# Altium project PT-15-V1.0.PrjPcb (part 5 of 7)

## Sheet 11-LED.schdoc
size A2
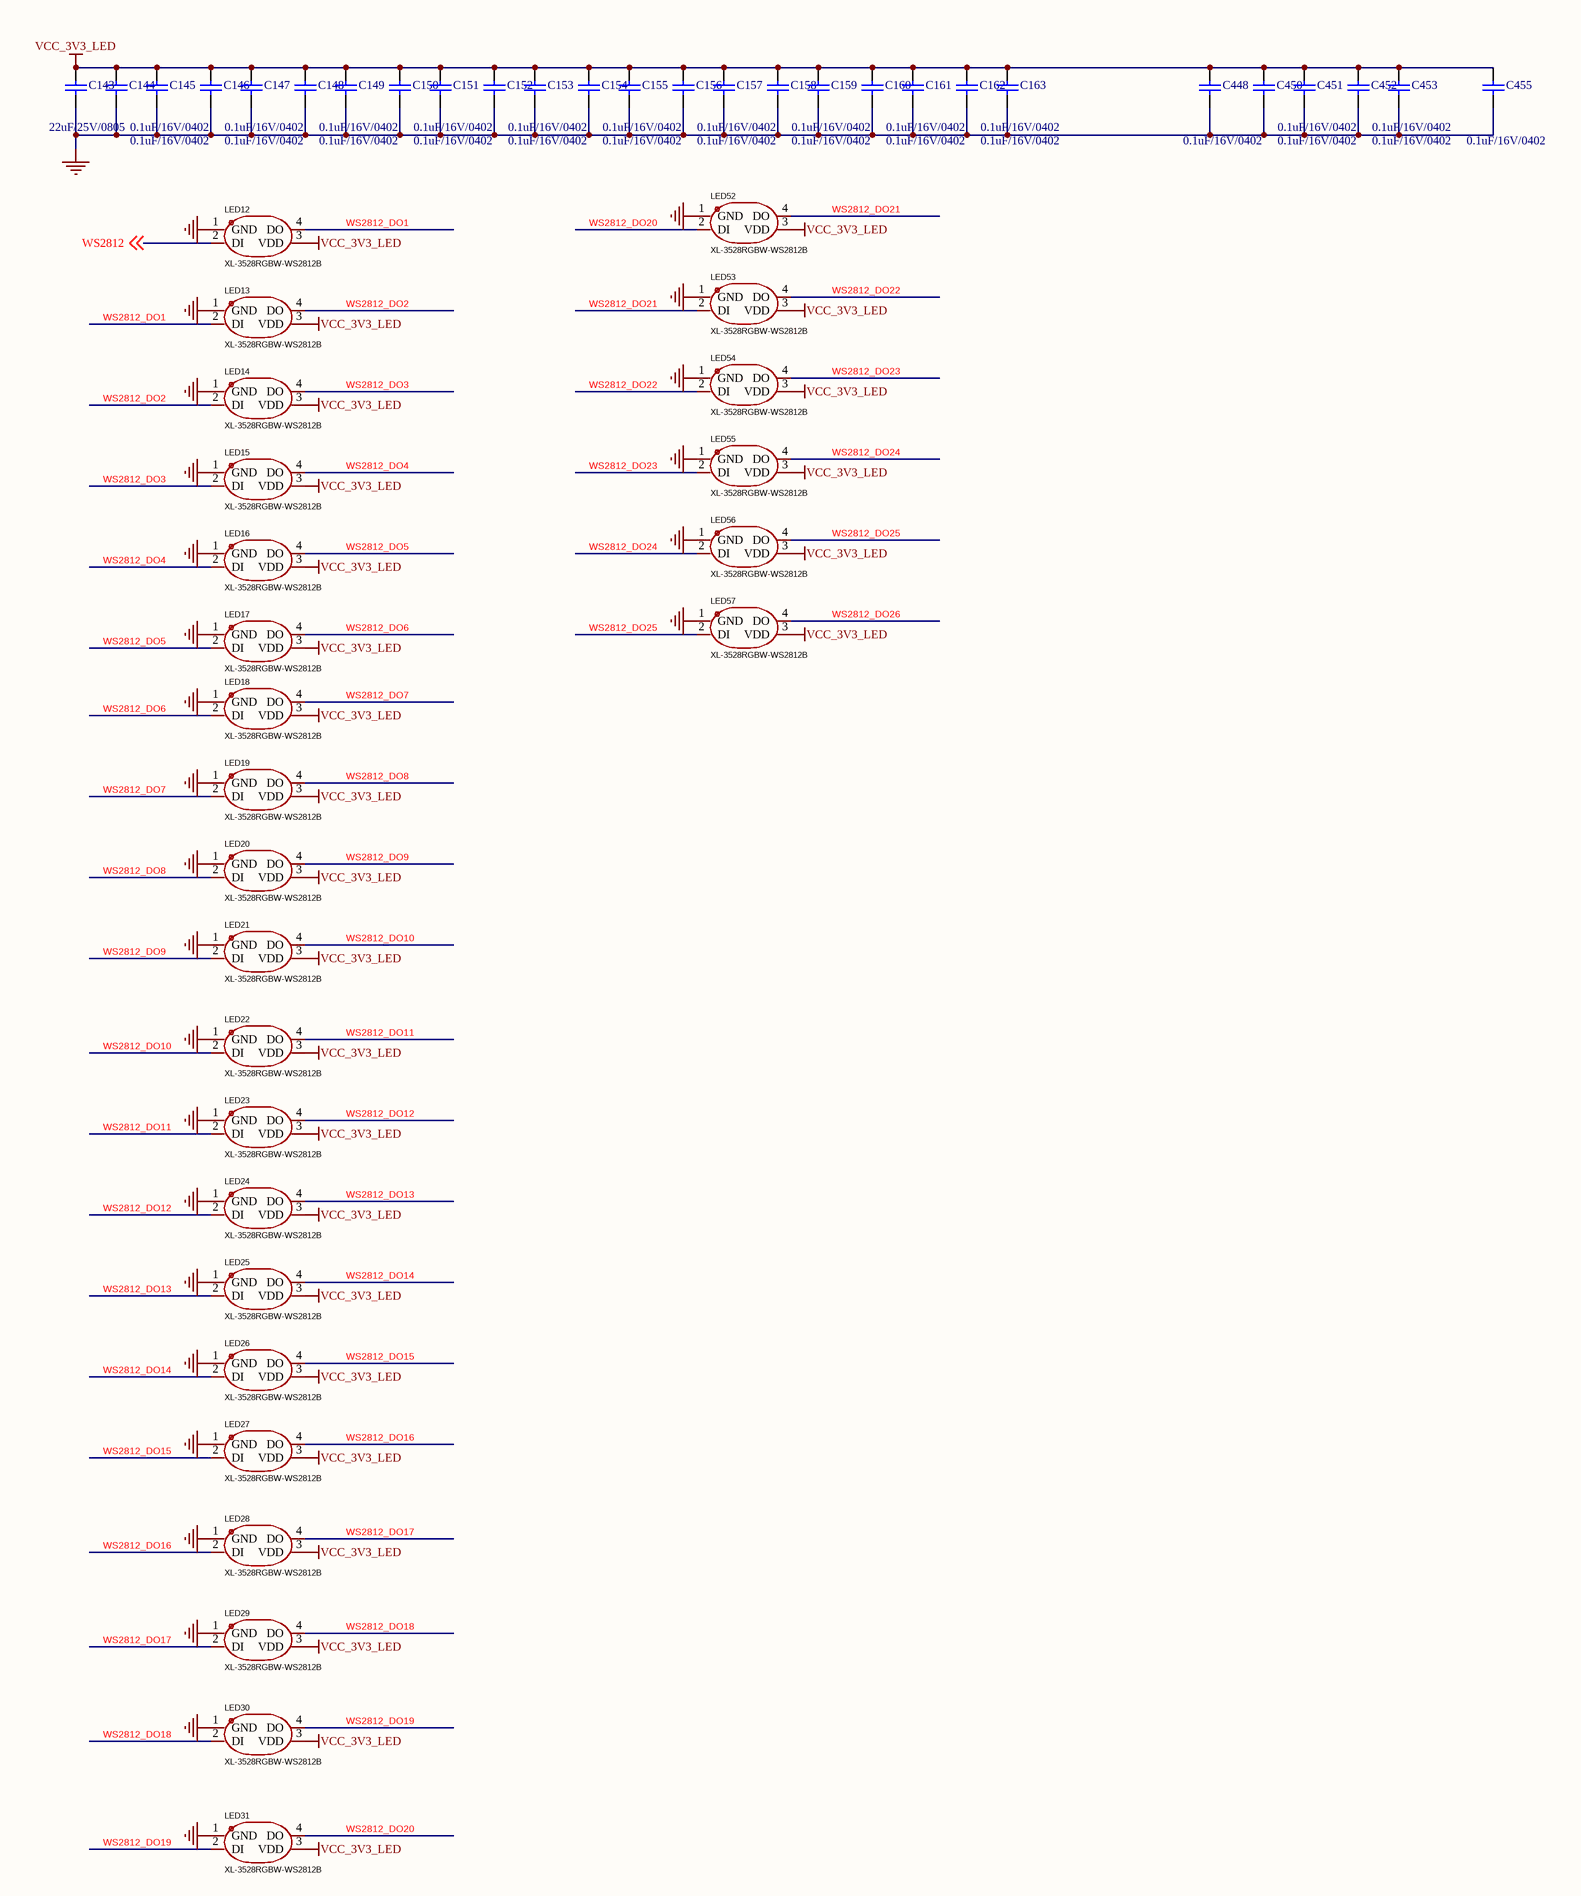
[diagram p14: 11-LED.schdoc]

### Parts
C143  22uF/25V/0805  [C0805]
C144  0.1uF/16V/0402  [C0402]
C145  0.1uF/16V/0402  [C0402]
C146  0.1uF/16V/0402  [C0402]
C147  0.1uF/16V/0402  [C0402]
C148  0.1uF/16V/0402  [C0402]
C149  0.1uF/16V/0402  [C0402]
C150  0.1uF/16V/0402  [C0402]
C151  0.1uF/16V/0402  [C0402]
C152  0.1uF/16V/0402  [C0402]
C153  0.1uF/16V/0402  [C0402]
C154  0.1uF/16V/0402  [C0402]
C155  0.1uF/16V/0402  [C0402]
C156  0.1uF/16V/0402  [C0402]
C157  0.1uF/16V/0402  [C0402]
C158  0.1uF/16V/0402  [C0402]
C159  0.1uF/16V/0402  [C0402]
C160  0.1uF/16V/0402  [C0402]
C161  0.1uF/16V/0402  [C0402]
C162  0.1uF/16V/0402  [C0402]
C163  0.1uF/16V/0402  [C0402]
C448  0.1uF/16V/0402  [C0402]
C450  0.1uF/16V/0402  [C0402]
C451  0.1uF/16V/0402  [C0402]
C452  0.1uF/16V/0402  [C0402]
C453  0.1uF/16V/0402  [C0402]
C455  0.1uF/16V/0402  [C0402]
LED12  XL-3528RGBW-WS2812B  [LED-SMD_4P-L3.5-W2.8-BR-1]
LED13  XL-3528RGBW-WS2812B  [LED-SMD_4P-L3.5-W2.8-BR-1]
LED14  XL-3528RGBW-WS2812B  [LED-SMD_4P-L3.5-W2.8-BR-1]
LED15  XL-3528RGBW-WS2812B  [LED-SMD_4P-L3.5-W2.8-BR-1]
LED16  XL-3528RGBW-WS2812B  [LED-SMD_4P-L3.5-W2.8-BR-1]
LED17  XL-3528RGBW-WS2812B  [LED-SMD_4P-L3.5-W2.8-BR-1]
LED18  XL-3528RGBW-WS2812B  [LED-SMD_4P-L3.5-W2.8-BR-1]
LED19  XL-3528RGBW-WS2812B  [LED-SMD_4P-L3.5-W2.8-BR-1]
LED20  XL-3528RGBW-WS2812B  [LED-SMD_4P-L3.5-W2.8-BR-1]
LED21  XL-3528RGBW-WS2812B  [LED-SMD_4P-L3.5-W2.8-BR-1]
LED22  XL-3528RGBW-WS2812B  [LED-SMD_4P-L3.5-W2.8-BR-1]
LED23  XL-3528RGBW-WS2812B  [LED-SMD_4P-L3.5-W2.8-BR-1]
LED24  XL-3528RGBW-WS2812B  [LED-SMD_4P-L3.5-W2.8-BR-1]
LED25  XL-3528RGBW-WS2812B  [LED-SMD_4P-L3.5-W2.8-BR-1]
LED26  XL-3528RGBW-WS2812B  [LED-SMD_4P-L3.5-W2.8-BR-1]
LED27  XL-3528RGBW-WS2812B  [LED-SMD_4P-L3.5-W2.8-BR-1]
LED28  XL-3528RGBW-WS2812B  [LED-SMD_4P-L3.5-W2.8-BR-1]
LED29  XL-3528RGBW-WS2812B  [LED-SMD_4P-L3.5-W2.8-BR-1]
LED30  XL-3528RGBW-WS2812B  [LED-SMD_4P-L3.5-W2.8-BR-1]
LED31  XL-3528RGBW-WS2812B  [LED-SMD_4P-L3.5-W2.8-BR-1]
LED52  XL-3528RGBW-WS2812B  [LED-SMD_4P-L3.5-W2.8-BR-1]
LED53  XL-3528RGBW-WS2812B  [LED-SMD_4P-L3.5-W2.8-BR-1]
LED54  XL-3528RGBW-WS2812B  [LED-SMD_4P-L3.5-W2.8-BR-1]
LED55  XL-3528RGBW-WS2812B  [LED-SMD_4P-L3.5-W2.8-BR-1]
LED56  XL-3528RGBW-WS2812B  [LED-SMD_4P-L3.5-W2.8-BR-1]
LED57  XL-3528RGBW-WS2812B  [LED-SMD_4P-L3.5-W2.8-BR-1]

### Nets
GND: C143.1 C144.1 C145.1 C146.1 C147.1 C148.1 C149.1 C150.1 C151.1 C152.1 C153.1 C154.1 C155.1 C156.1 C157.1 C158.1 C159.1 C160.1 C161.1 C162.1 C163.1 C448.1 C450.1 C451.1 C452.1 C453.1 C455.1 LED12.1(GND) LED13.1(GND) LED14.1(GND) LED15.1(GND) LED16.1(GND) LED17.1(GND) LED18.1(GND) LED19.1(GND) LED20.1(GND) LED21.1(GND) LED22.1(GND) LED23.1(GND) LED24.1(GND) LED25.1(GND) LED26.1(GND) LED27.1(GND) LED28.1(GND) LED29.1(GND) LED30.1(GND) LED31.1(GND) LED52.1(GND) LED53.1(GND) LED54.1(GND) LED55.1(GND) LED56.1(GND) LED57.1(GND)
VCC_3V3_LED: C143.2 C144.2 C145.2 C146.2 C147.2 C148.2 C149.2 C150.2 C151.2 C152.2 C153.2 C154.2 C155.2 C156.2 C157.2 C158.2 C159.2 C160.2 C161.2 C162.2 C163.2 C448.2 C450.2 C451.2 C452.2 C453.2 C455.2 LED12.3(VDD) LED13.3(VDD) LED14.3(VDD) LED15.3(VDD) LED16.3(VDD) LED17.3(VDD) LED18.3(VDD) LED19.3(VDD) LED20.3(VDD) LED21.3(VDD) LED22.3(VDD) LED23.3(VDD) LED24.3(VDD) LED25.3(VDD) LED26.3(VDD) LED27.3(VDD) LED28.3(VDD) LED29.3(VDD) LED30.3(VDD) LED31.3(VDD) LED52.3(VDD) LED53.3(VDD) LED54.3(VDD) LED55.3(VDD) LED56.3(VDD) LED57.3(VDD)
WS2812: LED12.2(DI) ; off-sheet WS2812
WS2812_DO1: LED12.4(DO) LED13.2(DI)
WS2812_DO2: LED13.4(DO) LED14.2(DI)
WS2812_DO3: LED14.4(DO) LED15.2(DI)
WS2812_DO4: LED15.4(DO) LED16.2(DI)
WS2812_DO5: LED16.4(DO) LED17.2(DI)
WS2812_DO6: LED17.4(DO) LED18.2(DI)
WS2812_DO7: LED18.4(DO) LED19.2(DI)
WS2812_DO8: LED19.4(DO) LED20.2(DI)
WS2812_DO9: LED20.4(DO) LED21.2(DI)
WS2812_DO10: LED21.4(DO) LED22.2(DI)
WS2812_DO11: LED22.4(DO) LED23.2(DI)
WS2812_DO12: LED23.4(DO) LED24.2(DI)
WS2812_DO13: LED24.4(DO) LED25.2(DI)
WS2812_DO14: LED25.4(DO) LED26.2(DI)
WS2812_DO15: LED26.4(DO) LED27.2(DI)
WS2812_DO16: LED27.4(DO) LED28.2(DI)
WS2812_DO17: LED28.4(DO) LED29.2(DI)
WS2812_DO18: LED29.4(DO) LED30.2(DI)
WS2812_DO19: LED30.4(DO) LED31.2(DI)
WS2812_DO20: LED31.4(DO) LED52.2(DI)
WS2812_DO21: LED52.4(DO) LED53.2(DI)
WS2812_DO22: LED53.4(DO) LED54.2(DI)
WS2812_DO23: LED54.4(DO) LED55.2(DI)
WS2812_DO24: LED55.4(DO) LED56.2(DI)
WS2812_DO25: LED56.4(DO) LED57.2(DI)
WS2812_DO26: LED57.4(DO)

### Library data of the parts
C143-C163 C448 C450-C453 C455 = CAP: Capacitor; Value: 100pF; Published: 8-Jun-2000; Revision: July-2002: Re-released for DXP Platform.; Publisher: Altium Limited
LED12-LED31 LED52-LED57 = XL-3528RGBW-WS2812B: Manufacturer: XINGLIGHT(成兴光); Add into BOM: yes; Symbol: XL-3528RGBW-WS2812B; Device: XL-3528RGBW-WS2812B; LCSC Part Name: XL-3528RGBW-WS2812B; Supplier Part: C2890364; Manufacturer Part: XL-3528RGBW-WS2812B; Supplier Footprint: SMD3528-4P; JLCPCB Part Class: Extended Part; Datasheet: https://atta.szlcsc.com/upload/public/pdf/source/20240218/041E1E0D0024617DFFF124D9C311BB4D.pdf; Supplier: LCSC; Convert to PCB: yes; Comment_1: XL-3528RGBW-WS2812B

## Sheet 12-RTL8111H-3.schdoc
size A2
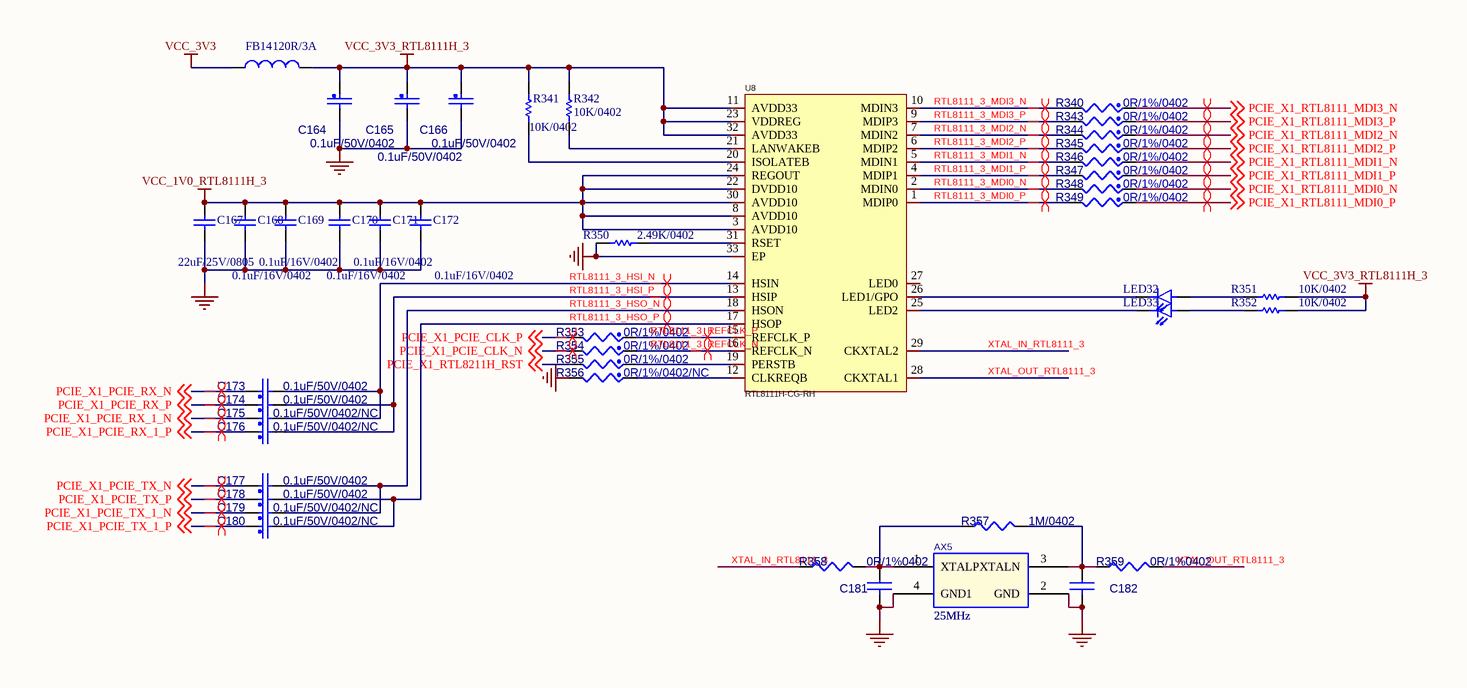
[diagram p15: 12-RTL8111H-3.schdoc]

### Parts
AX5  25MHz  [2016]
C164  value 0.1uF/50V/0402  [C0402]  (hidden comment: CAP_NP)
C165  value 0.1uF/50V/0402  [C0402]  (hidden comment: CAP_NP)
C166  value 0.1uF/50V/0402  [C0402]  (hidden comment: CAP_NP)
C167  22uF/25V/0805  [C0805]
C168  0.1uF/16V/0402  [C0402]
C169  0.1uF/16V/0402  [C0402]
C170  0.1uF/16V/0402  [C0402]
C171  0.1uF/16V/0402  [C0402]
C172  0.1uF/16V/0402  [C0402]
C173  value 0.1uF/50V/0402  [C0402]  (hidden comment: CAP_NP)
C174  value 0.1uF/50V/0402  [C0402]  (hidden comment: CAP_NP)
C175  value 0.1uF/50V/0402/NC  [C0402]  (hidden comment: CAP_NP)
C176  value 0.1uF/50V/0402/NC  [C0402]  (hidden comment: CAP_NP)
C177  value 0.1uF/50V/0402  [C0402]  (hidden comment: CAP_NP)
C178  value 0.1uF/50V/0402  [C0402]  (hidden comment: CAP_NP)
C179  value 0.1uF/50V/0402/NC  [C0402]  (hidden comment: CAP_NP)
C180  value 0.1uF/50V/0402/NC  [C0402]  (hidden comment: CAP_NP)
C181  CAP NP_Dup3  [C0402]  (value not drawn)
C182  CAP NP_Dup3  [C0402]  (value not drawn)
FB14  120R/3A  [L0603]
LED32  LED_GREEN  [LED0603]  (value not drawn)
LED33  LED_GREEN  [LED0603]  (value not drawn)
R340  value 0R/1%/0402  [R0402]  (hidden comment: RES_Dup2)
R341  10K/0402  [R0402]
R342  10K/0402  [R0402]
R343  value 0R/1%/0402  [R0402]  (hidden comment: RES_Dup2)
R344  value 0R/1%/0402  [R0402]  (hidden comment: RES_Dup2)
R345  value 0R/1%/0402  [R0402]  (hidden comment: RES_Dup2)
R346  value 0R/1%/0402  [R0402]  (hidden comment: RES_Dup2)
R347  value 0R/1%/0402  [R0402]  (hidden comment: RES_Dup2)
R348  value 0R/1%/0402  [R0402]  (hidden comment: RES_Dup2)
R349  value 0R/1%/0402  [R0402]  (hidden comment: RES_Dup2)
R350  2.49K/0402  [R0402]
R351  10K/0402  [R0402]
R352  10K/0402  [R0402]
R353  value 0R/1%/0402  [R0402]  (hidden comment: RES_Dup2)
R354  value 0R/1%/0402  [R0402]  (hidden comment: RES_Dup2)
R355  value 0R/1%/0402  [R0402]  (hidden comment: RES_Dup2)
R356  value 0R/1%/0402/NC  [R0402]  (hidden comment: RES_Dup2)
R357  value 1M/0402  [R0402]  (hidden comment: R_Dup3)
R358  value 0R/1%0402  [R0402]  (hidden comment: R_Dup3)
R359  value 0R/1%0402  [R0402]  (hidden comment: R_Dup3)
U8  RTL8111H-CG-RH  [RTL8111H-CG-RH]

### Nets
GND: AX5.2(GND) AX5.4(GND1) C164.2 C165.2 C166.2 C167.1 C168.1 C169.1 C170.1 C171.1 C172.1 C181.2 C182.2 R350.1 R356.2 U8.33(EP)
VCC_1V0_RTL8111H_3: C167.2 C168.2 C169.2 C170.2 C171.2 C172.2 U8.3(AVDD10) U8.8(AVDD10) U8.22(DVDD10) U8.24(REGOUT) U8.30(AVDD10)
VCC_3V3: FB14.1  [project net 3V3_ORIN_F1]
VCC_3V3_RTL8111H_3: C164.1 C165.1 C166.1 FB14.2 R341.1 R342.1 R351.1 R352.1 U8.11(AVDD33) U8.23(VDDREG) U8.32(AVDD33)
PCIE_X1_PCIE_CLK_N: R354.2 ; off-sheet PCIE_X1_PCIE_CLK_N
PCIE_X1_PCIE_CLK_P: R353.2 ; off-sheet PCIE_X1_PCIE_CLK_P
PCIE_X1_PCIE_RX_1_N: C175.1 ; off-sheet PCIE_X1_PCIE_RX_1_N
PCIE_X1_PCIE_RX_1_P: C176.1 ; off-sheet PCIE_X1_PCIE_RX_1_P
PCIE_X1_PCIE_RX_N: C173.1 ; off-sheet PCIE_X1_PCIE_RX_N
PCIE_X1_PCIE_RX_P: C174.1 ; off-sheet PCIE_X1_PCIE_RX_P
PCIE_X1_PCIE_TX_1_N: C179.1 ; off-sheet PCIE_X1_PCIE_TX_1_N
PCIE_X1_PCIE_TX_1_P: C180.1 ; off-sheet PCIE_X1_PCIE_TX_1_P
PCIE_X1_PCIE_TX_N: C177.1 ; off-sheet PCIE_X1_PCIE_TX_N
PCIE_X1_PCIE_TX_P: C178.1 ; off-sheet PCIE_X1_PCIE_TX_P
PCIE_X1_RTL8111_MDI0_N: R348.1 ; off-sheet PCIE_X1_RTL8111_MDI0_N
PCIE_X1_RTL8111_MDI0_P: R349.1 ; off-sheet PCIE_X1_RTL8111_MDI0_P
PCIE_X1_RTL8111_MDI1_N: R346.1 ; off-sheet PCIE_X1_RTL8111_MDI1_N
PCIE_X1_RTL8111_MDI1_P: R347.1 ; off-sheet PCIE_X1_RTL8111_MDI1_P
PCIE_X1_RTL8111_MDI2_N: R344.1 ; off-sheet PCIE_X1_RTL8111_MDI2_N
PCIE_X1_RTL8111_MDI2_P: R345.1 ; off-sheet PCIE_X1_RTL8111_MDI2_P
PCIE_X1_RTL8111_MDI3_N: R340.1 ; off-sheet PCIE_X1_RTL8111_MDI3_N
PCIE_X1_RTL8111_MDI3_P: R343.1 ; off-sheet PCIE_X1_RTL8111_MDI3_P
PCIE_X1_RTL8211H_RST: R355.2 ; off-sheet PCIE_X1_RTL8211H_RST
RTL8111_3_HSI_N: C173.2 C175.2 U8.14(HSIN)
RTL8111_3_HSI_P: C174.2 C176.2 U8.13(HSIP)
RTL8111_3_HSO_N: C177.2 C179.2 U8.18(HSON)
RTL8111_3_HSO_P: C178.2 C180.2 U8.17(HSOP)
RTL8111_3_MDI0_N: R348.2 U8.2(MDIN0)
RTL8111_3_MDI0_P: R349.2 U8.1(MDIP0)
RTL8111_3_MDI1_N: R346.2 U8.5(MDIN1)
RTL8111_3_MDI1_P: R347.2 U8.4(MDIP1)
RTL8111_3_MDI2_N: R344.2 U8.7(MDIN2)
RTL8111_3_MDI2_P: R345.2 U8.6(MDIP2)
RTL8111_3_MDI3_N: R340.2 U8.10(MDIN3)
RTL8111_3_MDI3_P: R343.2 U8.9(MDIP3)
RTL8111_3_REFCLK_N: R354.1 U8.16(REFCLK_N)
RTL8111_3_REFCLK_P: R353.1 U8.15(REFCLK_P)
XTAL_IN_RTL8111_3: R358.1 U8.29(CKXTAL2)
XTAL_OUT_RTL8111_3: R359.2 U8.28(CKXTAL1)
NetAX5_1: AX5.1(XTALP) C181.1 R357.1 R358.2
NetAX5_3: AX5.3(XTALN) C182.1 R357.2 R359.1
NetLED32_1: LED32.1 R351.2
NetLED32_2: LED32.2 U8.26(LED1/GPO)
NetLED33_1: LED33.1 R352.2
NetLED33_2: LED33.2 U8.25(LED2)
NetR341_2: R341.2 U8.20(ISOLATEB)
NetR342_2: R342.2 U8.21(LANWAKEB)
NetR350_2: R350.2 U8.31(RSET)
NetR355_1: R355.1 U8.19(PERSTB)
NetR356_1: R356.1 U8.12(CLKREQB)

Not connected (* = marked no-connect by the designer): U8 27(LED0)

### Layout directives
differential pair: PCIE_X1_PCIE_CLK_N, PCIE_X1_PCIE_CLK_P, PCIE_X1_PCIE_RX_1_N, PCIE_X1_PCIE_RX_1_P, PCIE_X1_PCIE_RX_N, PCIE_X1_PCIE_RX_P, PCIE_X1_PCIE_TX_1_N, PCIE_X1_PCIE_TX_1_P, PCIE_X1_PCIE_TX_N, PCIE_X1_PCIE_TX_P, PCIE_X1_RTL8111_MDI0_N, PCIE_X1_RTL8111_MDI0_P, PCIE_X1_RTL8111_MDI1_N, PCIE_X1_RTL8111_MDI1_P, PCIE_X1_RTL8111_MDI2_N, PCIE_X1_RTL8111_MDI2_P, PCIE_X1_RTL8111_MDI3_N, PCIE_X1_RTL8111_MDI3_P, RTL8111_3_HSI_N, RTL8111_3_HSI_P, RTL8111_3_HSO_N, RTL8111_3_HSO_P, RTL8111_3_MDI0_N, RTL8111_3_MDI0_P, RTL8111_3_MDI1_N, RTL8111_3_MDI1_P, RTL8111_3_MDI2_N, RTL8111_3_MDI2_P, RTL8111_3_MDI3_N, RTL8111_3_MDI3_P, RTL8111_3_REFCLK_N, RTL8111_3_REFCLK_P

### Library data of the parts
AX5 = XTAL_0: Part Reference: AX3; PCB Footprint: CRY5032; Value: 25MHz
C164-C166 C173-C180 = CAP_NP: GCM155R71H104KE02/MURATA; Part Reference: C15; CLASS: DISCRETE; FPLIST: CC0402_25,CC0402_HD,CC0402_CC; CAD_APPROVED: Yes; MFG_PN01: 0402YC104KAT2A; MFG_NAME01: AVX; Tolerance: 10%; AGILE_PN: 150-75182; VOLTAGE: 16V; HEIGHT: 0.635MM; ROHS: Yes; TOL: 10%; PCB Footprint: C0402
C167-C172 = CAP: Capacitor; Value: 100pF; Published: 8-Jun-2000; Revision: July-2002: Re-released for DXP Platform.; Publisher: Altium Limited
C181 = CAP NP_Dup3: Part Reference: C71; Value: 20pF/50V X7R; PCB Footprint: C0402
C182 = CAP NP_Dup3: Part Reference: C72; Value: 20pF/50V X7R; PCB Footprint: C0402
FB14 = Inductor: BLM18KG121TN1D; Code_IEC: 1005; Value: 10mH; Published: 8-Jun-2000; LatestRevisionDate: 29-May-2009; LatestRevisionNote: IPC-7351 Footprint Added.; PackageReference: 0402-A; Publisher: Altium Limited; PackageDescription: Chip Inductor; Code_JEITA: 0402
LED32 LED33 = LED
R340 R353 = RES_Dup2: AC0402FR-070RL/YAGEO; Part Reference: R97; CLASS: DISCRETE; SIGNAL_MODEL: DEFAULT_RESISTOR_33.000000OHM_2_1; FPLIST: RC0603_OV; CAD_APPROVED: Yes; MFG_PN01: CR-02FL6---33R; MFG_NAME01: YAGEO; Tolerance: 1%; AGILE_PN: 470-75790; TOL: 5%; ROHS: Yes; HEIGHT: 0.4MM; PCB Footprint: R0402
R341 R342 R350 = Res Semi: Semiconductor Resistor; Value: 240R; Published: 8-Jun-2000; LatestRevisionDate: 17-Jul-2002; LatestRevisionNote: Re-released for DXP Platform.; PackageReference: AXIAL-0.5; Publisher: Altium Limited; PackageDescription: Axial Device, Thru-Hole; 2 Leads; 0.5 in Pin Spacing
R343 R354-R356 = RES_Dup2: AC0402FR-070RL/YAGEO; Part Reference: R98; CLASS: DISCRETE; TOL: 5%; AGILE_PN: 470-75790; Tolerance: 1%; MFG_NAME01: YAGEO; MFG_PN01: CR-02FL6---33R; CAD_APPROVED: Yes; FPLIST: RC0603_OV; SIGNAL_MODEL: DEFAULT_RESISTOR_33.000000OHM_2_1; HEIGHT: 0.4MM; ROHS: Yes; PCB Footprint: R0402
R344 = RES_Dup2: AC0402FR-070RL/YAGEO; Part Reference: R99; CLASS: DISCRETE; TOL: 5%; AGILE_PN: 470-75790; Tolerance: 1%; MFG_NAME01: YAGEO; MFG_PN01: CR-02FL6---33R; CAD_APPROVED: Yes; FPLIST: RC0603_OV; SIGNAL_MODEL: DEFAULT_RESISTOR_33.000000OHM_2_1; HEIGHT: 0.4MM; ROHS: Yes; PCB Footprint: R0402
R345 = RES_Dup2: AC0402FR-070RL/YAGEO; Part Reference: R101; CLASS: DISCRETE; TOL: 5%; AGILE_PN: 470-75790; Tolerance: 1%; MFG_NAME01: YAGEO; MFG_PN01: CR-02FL6---33R; CAD_APPROVED: Yes; FPLIST: RC0603_OV; SIGNAL_MODEL: DEFAULT_RESISTOR_33.000000OHM_2_1; HEIGHT: 0.4MM; ROHS: Yes; PCB Footprint: R0402
R346 = RES_Dup2: AC0402FR-070RL/YAGEO; Part Reference: R102; CLASS: DISCRETE; TOL: 5%; AGILE_PN: 470-75790; Tolerance: 1%; MFG_NAME01: YAGEO; MFG_PN01: CR-02FL6---33R; CAD_APPROVED: Yes; FPLIST: RC0603_OV; SIGNAL_MODEL: DEFAULT_RESISTOR_33.000000OHM_2_1; HEIGHT: 0.4MM; ROHS: Yes; PCB Footprint: R0402
R347 = RES_Dup2: AC0402FR-070RL/YAGEO; Part Reference: R103; CLASS: DISCRETE; TOL: 5%; AGILE_PN: 470-75790; Tolerance: 1%; MFG_NAME01: YAGEO; MFG_PN01: CR-02FL6---33R; CAD_APPROVED: Yes; FPLIST: RC0603_OV; SIGNAL_MODEL: DEFAULT_RESISTOR_33.000000OHM_2_1; HEIGHT: 0.4MM; ROHS: Yes; PCB Footprint: R0402
R348 = RES_Dup2: AC0402FR-070RL/YAGEO; Part Reference: R104; CLASS: DISCRETE; TOL: 5%; AGILE_PN: 470-75790; Tolerance: 1%; MFG_NAME01: YAGEO; MFG_PN01: CR-02FL6---33R; CAD_APPROVED: Yes; FPLIST: RC0603_OV; SIGNAL_MODEL: DEFAULT_RESISTOR_33.000000OHM_2_1; HEIGHT: 0.4MM; ROHS: Yes; PCB Footprint: R0402
R349 = RES_Dup2: AC0402FR-070RL/YAGEO; Part Reference: R105; CLASS: DISCRETE; TOL: 5%; AGILE_PN: 470-75790; Tolerance: 1%; MFG_NAME01: YAGEO; MFG_PN01: CR-02FL6---33R; CAD_APPROVED: Yes; FPLIST: RC0603_OV; SIGNAL_MODEL: DEFAULT_RESISTOR_33.000000OHM_2_1; HEIGHT: 0.4MM; ROHS: Yes; PCB Footprint: R0402
R351 R352 = Res Semi: Semiconductor Resistor; Value: 1K; Published: 8-Jun-2000; LatestRevisionDate: 17-Jul-2002; LatestRevisionNote: Re-released for DXP Platform.; PackageReference: AXIAL-0.5; Publisher: Altium Limited; PackageDescription: Axial Device, Thru-Hole; 2 Leads; 0.5 in Pin Spacing
R357 R358 = R_Dup3: Part Reference: R130; PCB Footprint: R0402
R359 = R_Dup3: Part Reference: R131; PCB Footprint: R0402
U8 = RTL8111H-CG: Manufacturer: REALTEK(瑞昱); Add into BOM: yes; Symbol: RTL8111H-CG; Device: RTL8111H-CG; LCSC Part Name: RTL8111H-CG; Supplier Part: C2761340; Manufacturer Part: RTL8111H-CG; Supplier Footprint: QFN-32-EP(4x4); JLCPCB Part Class: Extended Part; Datasheet: https://atta.szlcsc.com/upload/public/pdf/source/20210810/FF05C5D46F518898BC2EC053E52D54B5.pdf; Supplier: LCSC; Convert to PCB: yes; Comment_1: RTL8111H-CG

## Sheet 13-AX88179A.SchDoc: RTL9010AA Reference Design: RTL9010AA
size 817 x 513 mm; Page Create Date: March  8, 1995; OrgName: Realtek Semiconductor Corp.; OrgAddr1: No.2, Innovation Road II, Hsinchu Science Park, Hsinchu 300, Taiwan; Page Number: 2; Page Size: D; Page Count: 5; RevCode: 1.0; Doc: RTL9010AA Reference Design; DsnPath: C:\Users\Administrator\Desktop\123\KARGOBOT-TCU-ORIN-V1.1.DSN; SchematicName: KARGOBT-TCU-ORIN-V1.1; PageName: P2-AX88179A; PageSize: D; TopSchematic: True
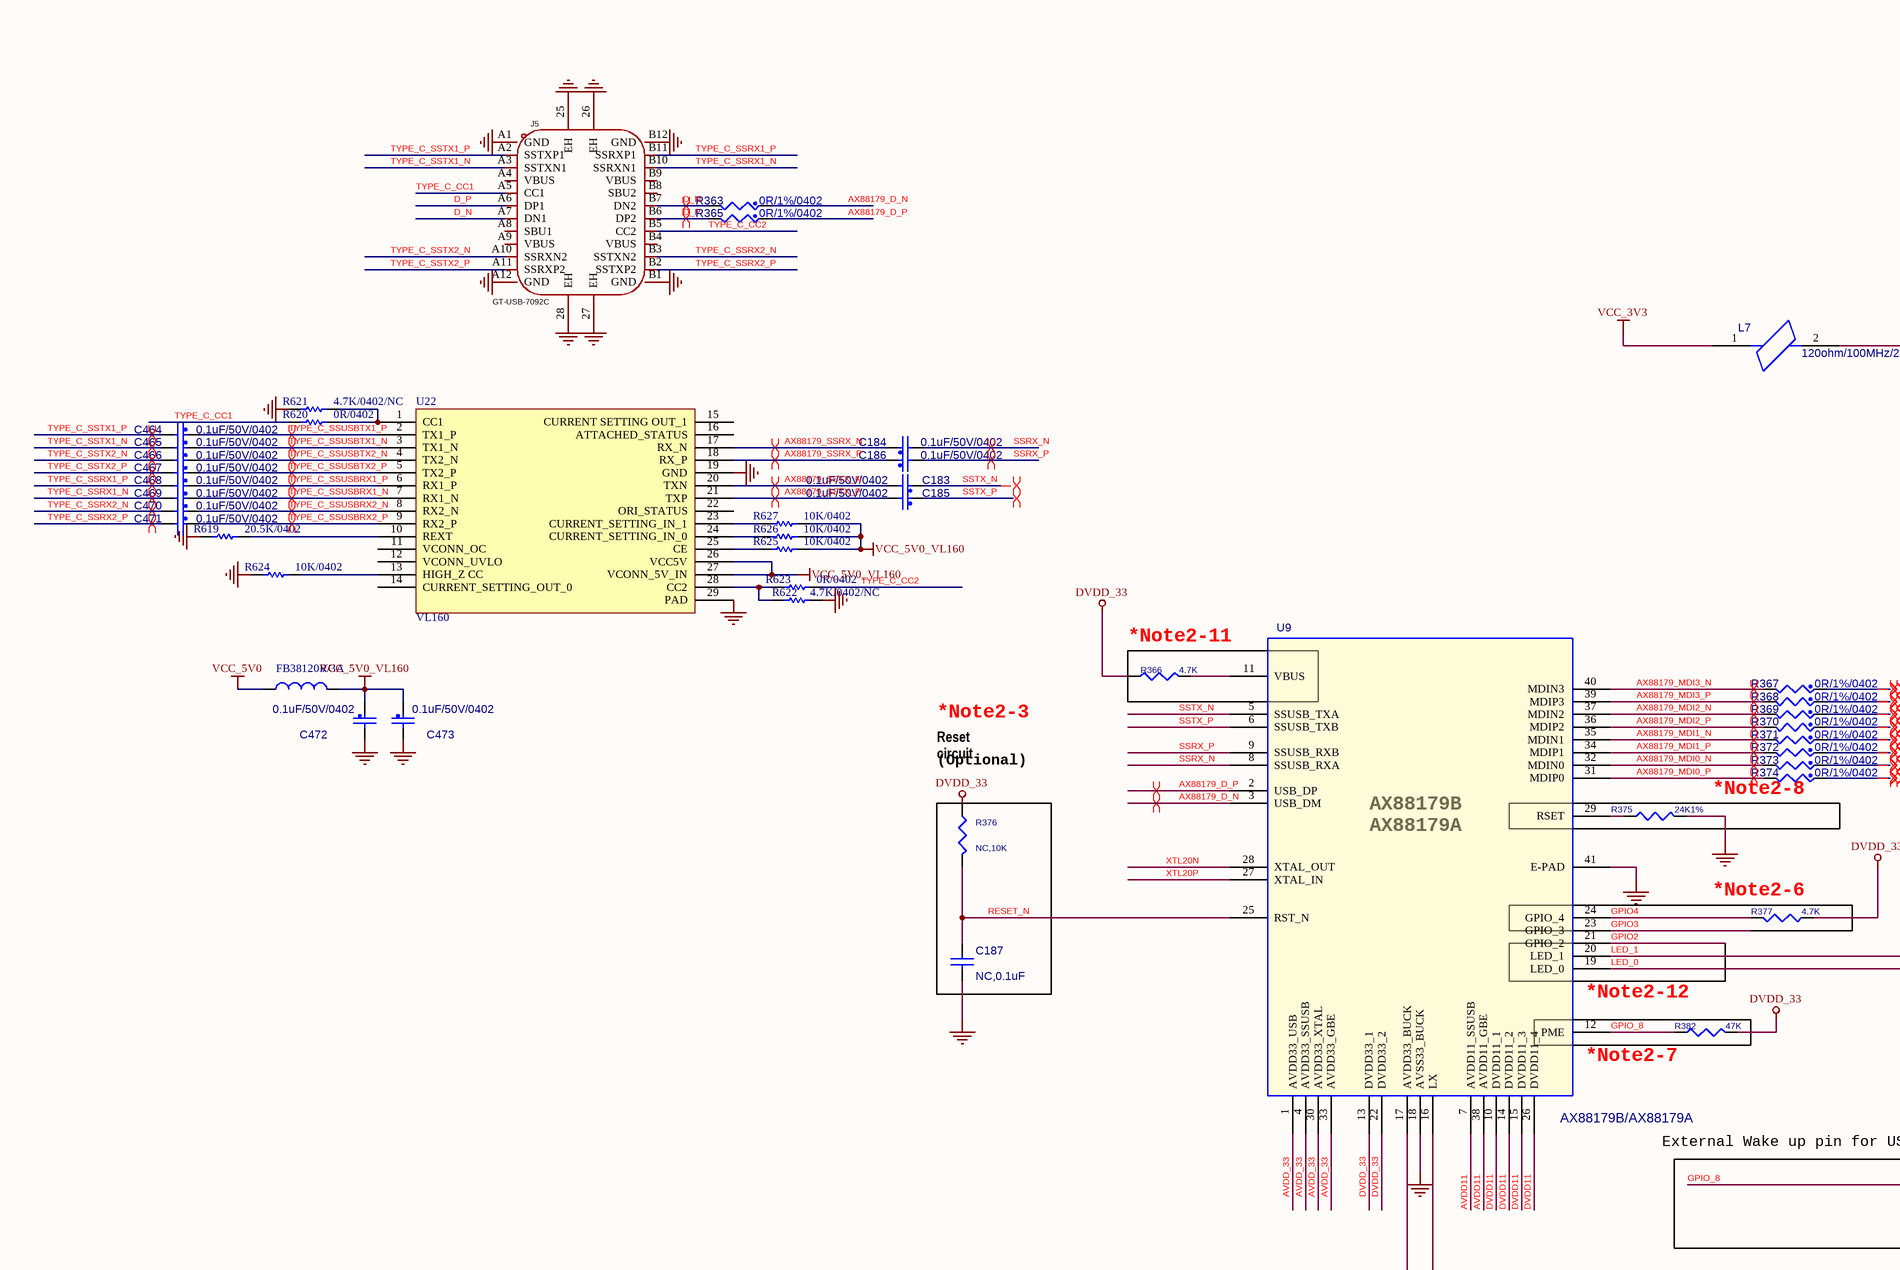
[diagram p16: 13-AX88179A.SchDoc, top left]
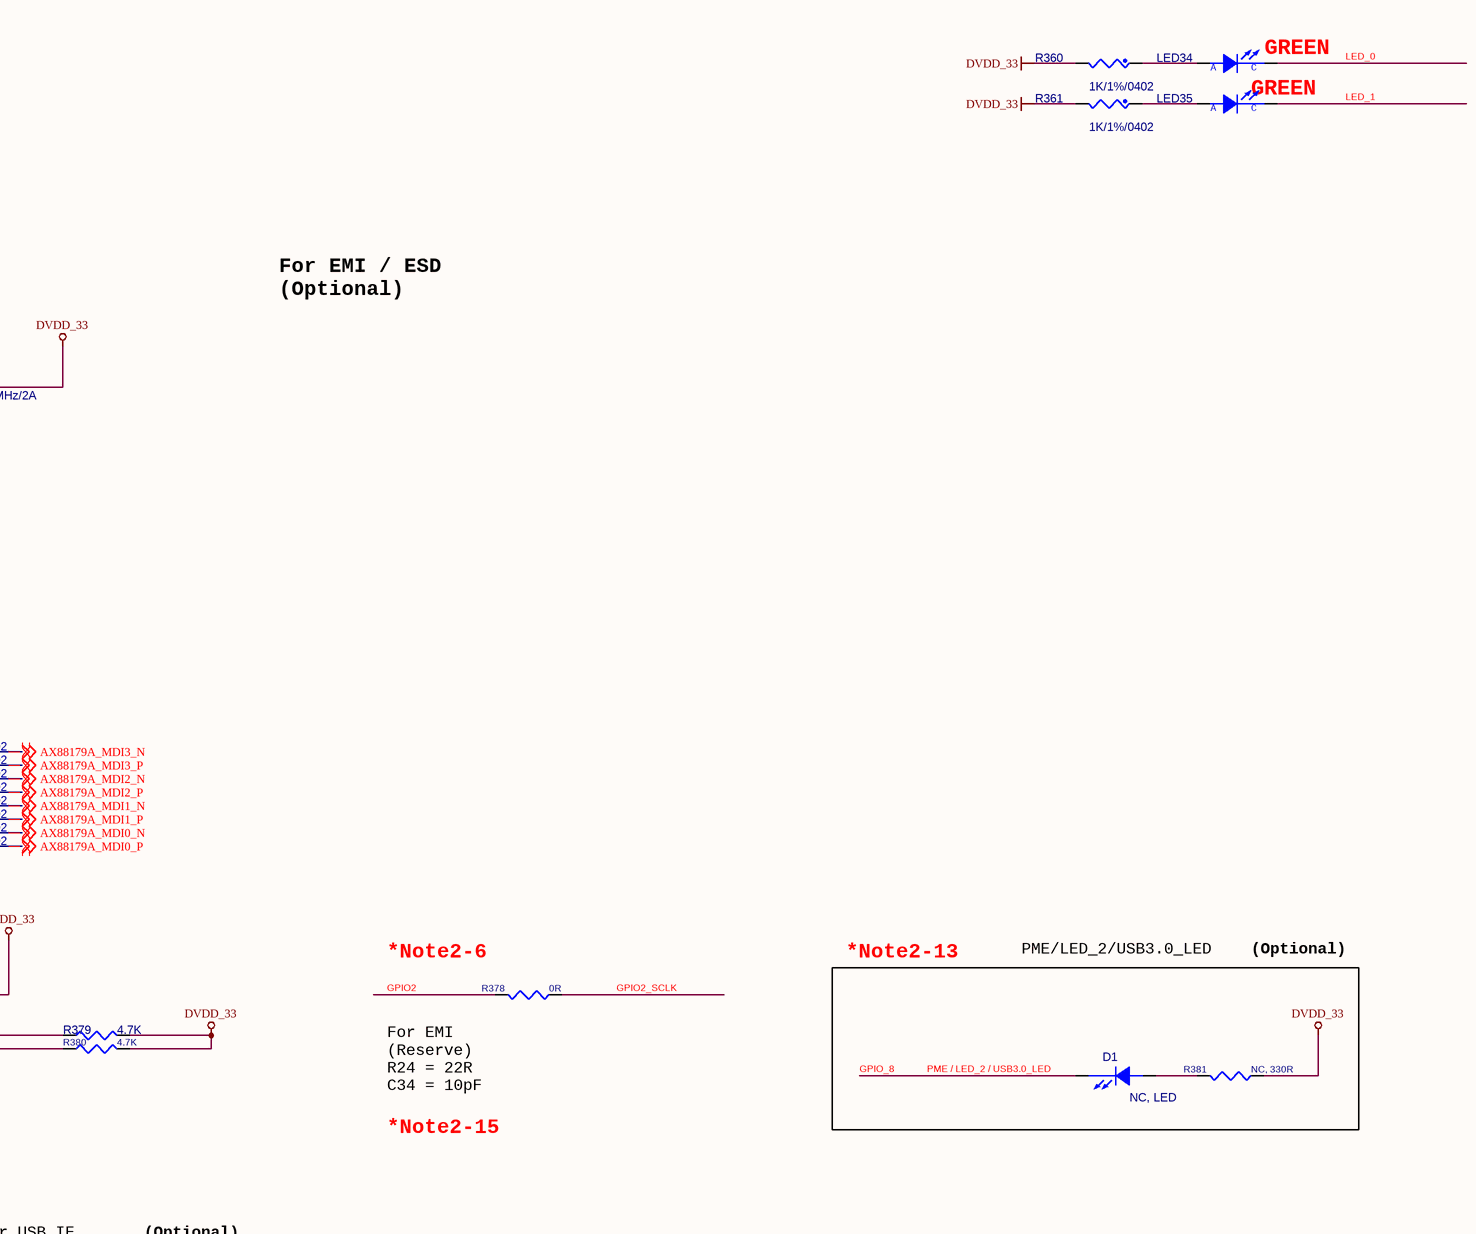
[diagram p17: 13-AX88179A.SchDoc, top right]
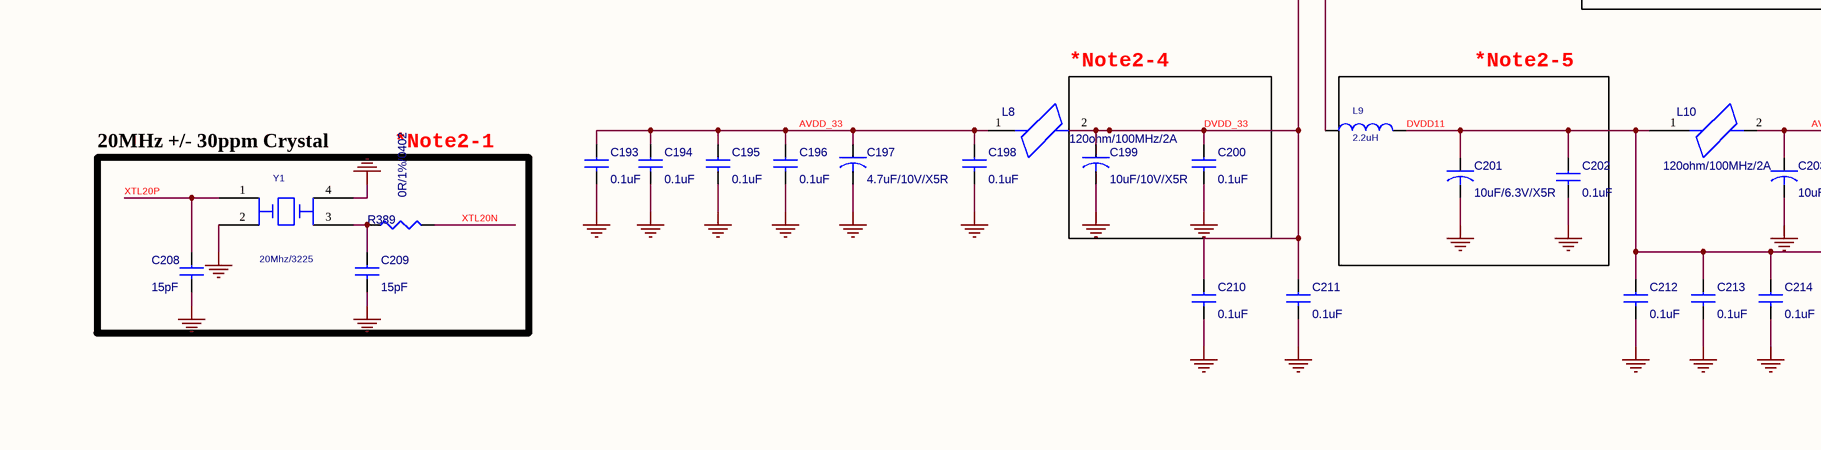
[diagram p18: 13-AX88179A.SchDoc, bottom left]
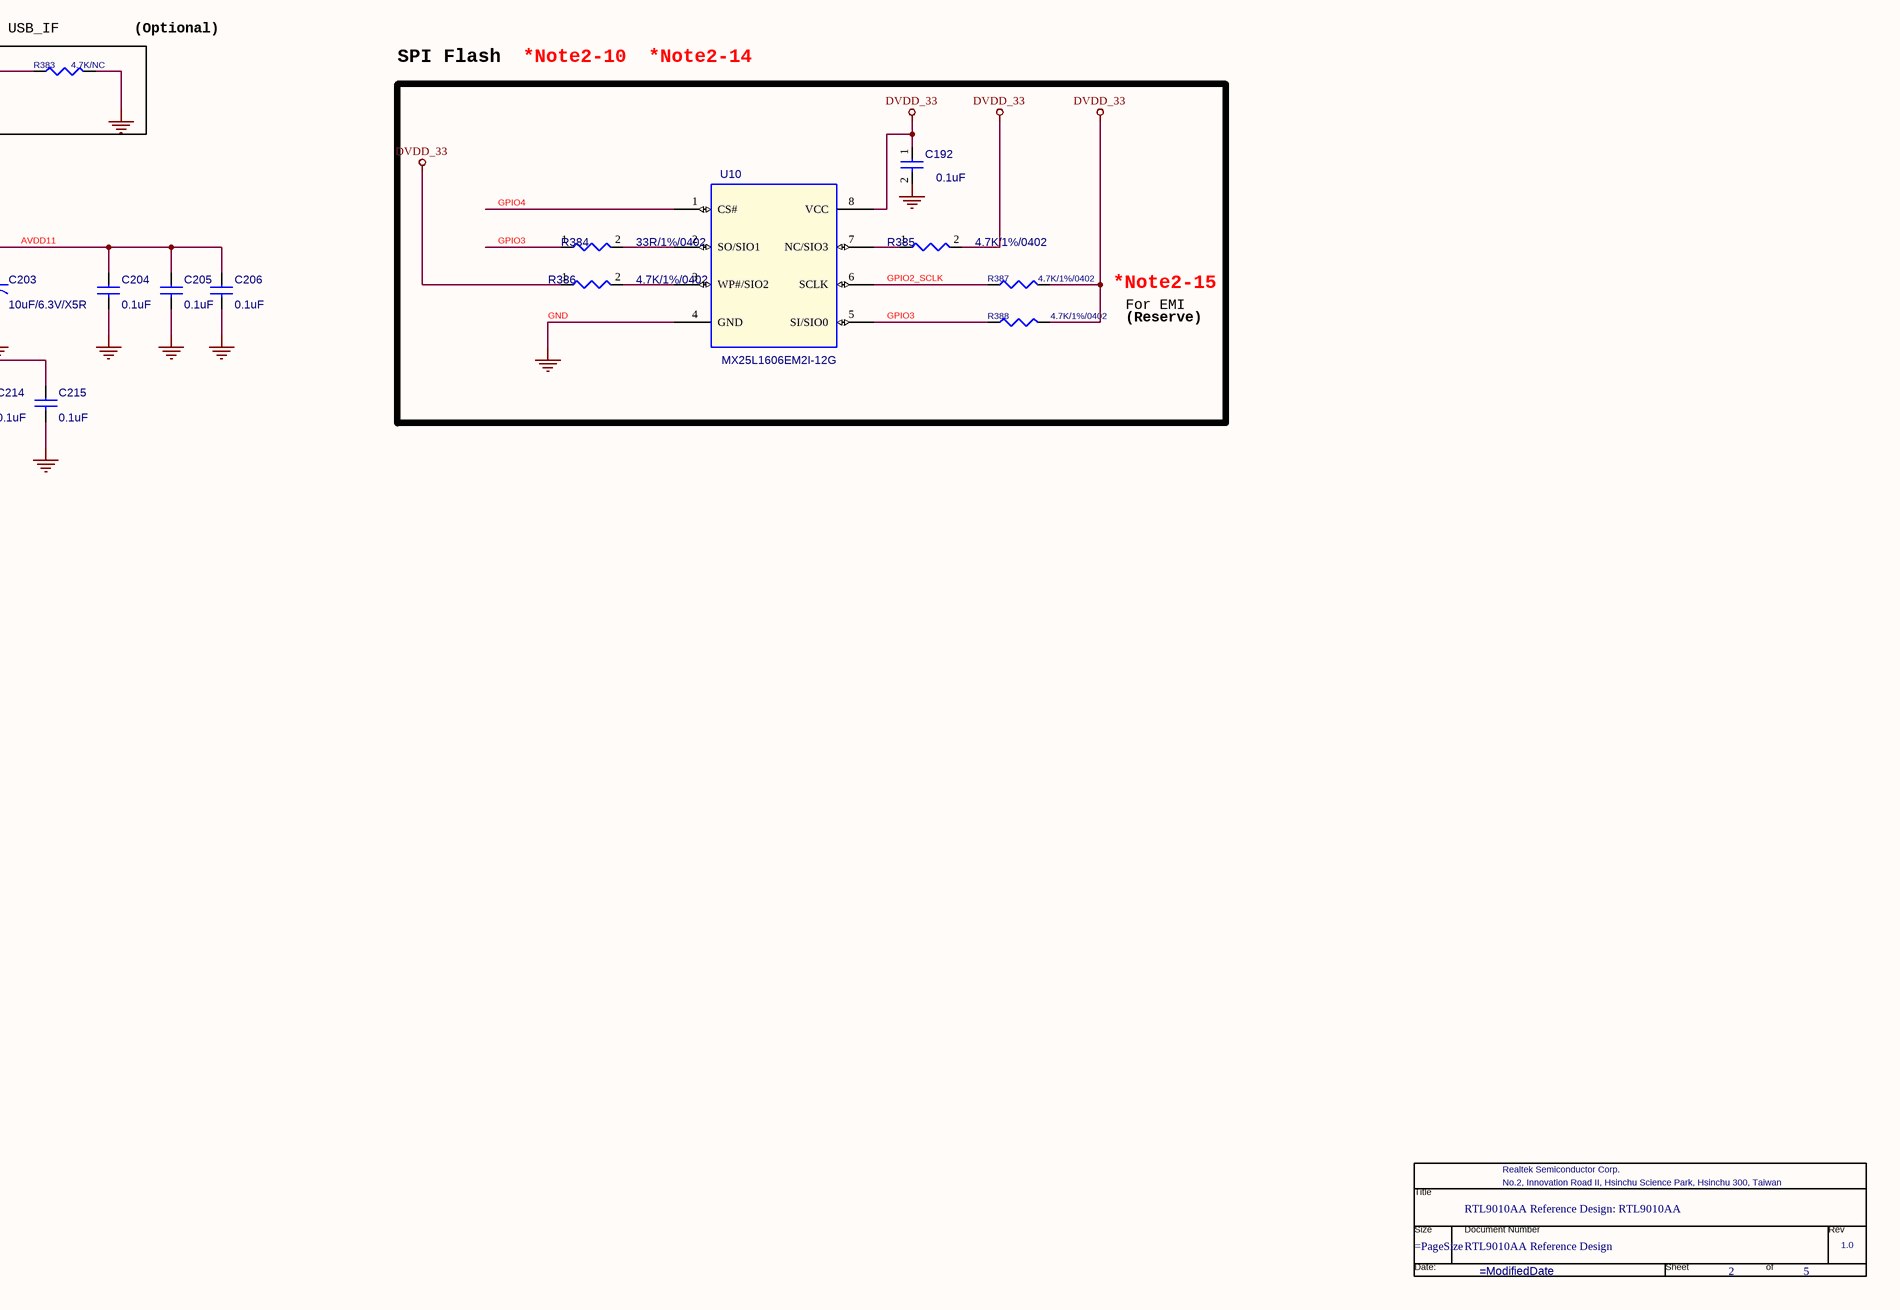
[diagram p19: 13-AX88179A.SchDoc, bottom right]

### Parts
(Parts that share a designator on the sheet are numbered #1, #2 ... from top to bottom, then left to right.)
*#9  Doc: RTL9010AA Reference Design  RevCode: 1.0  Title: RTL9010AA Reference Design: RTL9010AA  Page Number: 2  Page Count: 5  OrgName: Realtek Semiconductor Corp.  OrgAddr1: No.2, Innovation Road II, Hsinchu Science Park, Hsinchu 300, Taiwan  (graphical)
C183  value 0.1uF/50V/0402  [C0402]  (hidden comment: CAP_NP)
C184  value 0.1uF/50V/0402  [C0402]  (hidden comment: CAP_NP)
C185  value 0.1uF/50V/0402  [C0402]  (hidden comment: CAP_NP)
C186  value 0.1uF/50V/0402  [C0402]  (hidden comment: CAP_NP)
C187  value NC,0.1uF  [C0402]  (hidden comment: CAP NP_Dup2)
C192  0.1uF  [C0402]
C193  value 0.1uF  [C0402]  (hidden comment: CAP NP_Dup2)
C194  value 0.1uF  [C0402]  (hidden comment: CAP NP_Dup2)
C195  value 0.1uF  [C0402]  (hidden comment: CAP NP_Dup2)
C196  value 0.1uF  [C0402]  (hidden comment: CAP NP_Dup2)
C197  value 4.7uF/10V/X5R  [C0603]  (hidden comment: C_Dup1)
C198  value 0.1uF  [C0402]  (hidden comment: CAP NP_Dup2)
C199  value 10uF/10V/X5R  [C0603]  (hidden comment: C_Dup1)
C200  value 0.1uF  [C0402]  (hidden comment: CAP NP_Dup2)
C201  value 10uF/6.3V/X5R  [C0603]  (hidden comment: C_Dup1)
C202  value 0.1uF  [C0402]  (hidden comment: CAP NP_Dup2)
C203  value 10uF/6.3V/X5R  [C0603]  (hidden comment: C_Dup1)
C204  value 0.1uF  [C0402]  (hidden comment: CAP NP_Dup2)
C205  value 0.1uF  [C0402]  (hidden comment: CAP NP_Dup2)
C206  value 0.1uF  [C0402]  (hidden comment: CAP NP_Dup2)
C208  value 15pF  [C0402]  (hidden comment: CAP NP_Dup1)
C209  value 15pF  [C0402]  (hidden comment: CAP NP_Dup1)
C210  value 0.1uF  [C0402]  (hidden comment: CAP NP_Dup2)
C211  value 0.1uF  [C0402]  (hidden comment: CAP NP_Dup2)
C212  value 0.1uF  [C0402]  (hidden comment: CAP NP_Dup2)
C213  value 0.1uF  [C0402]  (hidden comment: CAP NP_Dup2)
C214  value 0.1uF  [C0402]  (hidden comment: CAP NP_Dup2)
C215  value 0.1uF  [C0402]  (hidden comment: CAP NP_Dup2)
C464  value 0.1uF/50V/0402  [C0402]  (hidden comment: CAP_NP)
C465  value 0.1uF/50V/0402  [C0402]  (hidden comment: CAP_NP)
C466  value 0.1uF/50V/0402  [C0402]  (hidden comment: CAP_NP)
C467  value 0.1uF/50V/0402  [C0402]  (hidden comment: CAP_NP)
C468  value 0.1uF/50V/0402  [C0402]  (hidden comment: CAP_NP)
C469  value 0.1uF/50V/0402  [C0402]  (hidden comment: CAP_NP)
C470  value 0.1uF/50V/0402  [C0402]  (hidden comment: CAP_NP)
C471  value 0.1uF/50V/0402  [C0402]  (hidden comment: CAP_NP)
C472  value 0.1uF/50V/0402  [C0402]  (hidden comment: CAP_NP)
C473  value 0.1uF/50V/0402  [C0402]  (hidden comment: CAP_NP)
D1  value NC, LED  [LED0603]  (hidden comment: LED)
FB38  120R/3A  [L0603]
J5  GT-USB-7092C  [USB-C-SMD_GT-USB-7092C]
L7  value 120ohm/100MHz/2A  [L0603]  (hidden comment: BEAD_FERRITE)
L8  value 120ohm/100MHz/2A  [L0603]  (hidden comment: BEAD_FERRITE)
L9  value 2.2uH  [L0805]  (hidden comment: INDUCTOR)
L10  value 120ohm/100MHz/2A  [L0603]  (hidden comment: BEAD_FERRITE)
LED34  LED_P2_Dup1  [LED0603]  (value not drawn)
LED35  LED_P2_Dup1  [LED0603]  (value not drawn)
R360  value 1K/1%/0402  [R0402]  (hidden comment: RES_Dup2)
R361  value 1K/1%/0402  [R0402]  (hidden comment: RES_Dup2)
R363  value 0R/1%/0402  [R0402]  (hidden comment: RES_Dup2)
R365  value 0R/1%/0402  [R0402]  (hidden comment: RES_Dup2)
R366  4.7K  [R0402]
R367  value 0R/1%/0402  [R0402]  (hidden comment: RES_Dup2)
R368  value 0R/1%/0402  [R0402]  (hidden comment: RES_Dup2)
R369  value 0R/1%/0402  [R0402]  (hidden comment: RES_Dup2)
R370  value 0R/1%/0402  [R0402]  (hidden comment: RES_Dup2)
R371  value 0R/1%/0402  [R0402]  (hidden comment: RES_Dup2)
R372  value 0R/1%/0402  [R0402]  (hidden comment: RES_Dup2)
R373  value 0R/1%/0402  [R0402]  (hidden comment: RES_Dup2)
R374  value 0R/1%/0402  [R0402]  (hidden comment: RES_Dup2)
R375  value 24K1%  [R0402]  (hidden comment: 24K/1%/0402)
R376  value NC,10K  [R0402]  (hidden comment: R)
R377  value 4.7K  [R0402]  (hidden comment: R_Dup1)
R378  value 0R  [R0402]  (hidden comment: R_Dup2)
R379  value 4.7K  [R0402]  (hidden comment: R_Dup4)
R380  value 4.7K  [R0402]  (hidden comment: R_Dup1)
R381  value NC, 330R  [R0402]  (hidden comment: R_Dup2)
R382  value 47K  [R0402]  (hidden comment: R_Dup2)
R383  value 4.7K/NC  [R0402]  (hidden comment: R_Dup2)
R384  33R/1%/0402  [R0402]
R385  4.7K/1%/0402  [R0402]
R386  4.7K/1%/0402  [R0402]
R387  4.7K/1%/0402  [R0402]
R388  4.7K/1%/0402  [R0402]
R389  0R/1%/0402  [R0402]
R619  20.5K/0402  [R0402]
R620  0R/0402  [R0402]
R621  4.7K/0402/NC  [R0402]
R622  4.7K/0402/NC  [R0402]
R623  0R/0402  [R0402]
R624  10K/0402  [R0402]
R625  10K/0402  [R0402]
R626  10K/0402  [R0402]
R627  10K/0402  [R0402]
U9  AX88179B/AX88179A  [AX88179]
U10  MX25L1606EM2I-12G  [MX25L1606EM2I-12G]
U22  VL160  [VL160]
Y1  20Mhz/3225  [3225]

### Blocks framed on the sheet
*Note2-11: R366
*Note2-8: R375
*Note2-6: R377
*Note2-13: D1 R381
*Note2-12: R382
(Optional): R383
*Note2-4: C199 C200
*Note2-5: C201 C202 L9

### Nets
DVDD_33: C192.1 C199.1 C200.1 C210.1 C211.1 L7.2 L8.2 R360.2 R361.2 R366.1 R376.1 R377.1 R379.2 R380.2 R381.1 R382.2 R385.2 R386.1 R387.2 R388.2 U9.13(DVDD33_1) U9.17(AVDD33_BUCK) U9.22(DVDD33_2) U10.8(VCC)
GND: C187.2 C192.2 C193.2 C194.2 C195.2 C196.2 C197.2 C198.2 C199.2 C200.2 C201.2 C202.2 C203.2 C204.2 C205.2 C206.2 C208.2 C209.2 C210.2 C211.2 C212.2 C213.2 C214.2 C215.2 C472.2 C473.2 J5.25(EH) J5.26(EH) J5.27(EH) J5.28(EH) J5.A1(GND) J5.A12(GND) J5.B1(GND) J5.B12(GND) R375.2 R383.2 R619.1 R621.1 R622.1 R624.1 U9.18(AVSS33_BUCK) U9.41(E-PAD) U10.4(GND) U22.19(GND) U22.29(PAD) Y1.2 Y1.4
VCC_3V3: L7.1  [project net 3V3_ORIN_F1]
VCC_5V0: FB38.1
VCC_5V0_VL160: C472.1 C473.1 FB38.2 R625.2 R626.2 R627.2 U22.26(VCC5V) U22.27(VCONN_5V_IN)
AVDD11: C203.1 C204.1 C205.1 C206.1 L10.2 U9.7(AVDD11_SSUSB) U9.38(AVDD11_GBE)
AVDD_33: C193.1 C194.1 C195.1 C196.1 C197.1 C198.1 L8.1 U9.1(AVDD33_USB) U9.4(AVDD33_SSUSB) U9.30(AVDD33_XTAL) U9.33(AVDD33_GBE)
AX88179_D_N: R363.1 U9.3(USB_DM)
AX88179_D_P: R365.1 U9.2(USB_DP)
AX88179_MDI0_N: R373.2 U9.32(MDIN0)
AX88179_MDI0_P: R374.2 U9.31(MDIP0)
AX88179_MDI1_N: R371.2 U9.35(MDIN1)
AX88179_MDI1_P: R372.2 U9.34(MDIP1)
AX88179_MDI2_N: R369.2 U9.37(MDIN2)
AX88179_MDI2_P: R370.2 U9.36(MDIP2)
AX88179_MDI3_N: R367.2 U9.40(MDIN3)
AX88179_MDI3_P: R368.2 U9.39(MDIP3)
AX88179_SSRX_N: C184.1 U22.17(RX_N)
AX88179_SSRX_P: C186.1 U22.18(RX_P)
AX88179_SSTX_N: C183.2 U22.20(TXN)
AX88179_SSTX_P: C185.2 U22.21(TXP)
AX88179A_MDI0_N: R373.1 ; off-sheet AX88179A_MDI0_N
AX88179A_MDI0_P: R374.1 ; off-sheet AX88179A_MDI0_P
AX88179A_MDI1_N: R371.1 ; off-sheet AX88179A_MDI1_N
AX88179A_MDI1_P: R372.1 ; off-sheet AX88179A_MDI1_P
AX88179A_MDI2_N: R369.1 ; off-sheet AX88179A_MDI2_N
AX88179A_MDI2_P: R370.1 ; off-sheet AX88179A_MDI2_P
AX88179A_MDI3_N: R367.1 ; off-sheet AX88179A_MDI3_N
AX88179A_MDI3_P: R368.1 ; off-sheet AX88179A_MDI3_P
D_N: J5.A7(DN1) J5.B7(DN2) R363.2
D_P: J5.A6(DP1) J5.B6(DP2) R365.2
DVDD11: C201.1 C202.1 C212.1 C213.1 C214.1 C215.1 L9.2 L10.1 U9.10(DVDD11_1) U9.14(DVDD11_2) U9.15(DVDD11_3) U9.26(DVDD11_4)
GPIO2: R378.2 U9.21(GPIO_2)
GPIO2_SCLK: R378.1 R387.1 U10.6(SCLK)
GPIO3: R384.1 R388.1 U9.23(GPIO_3) U10.5(SI/SIO0)
GPIO4: R377.2 U9.24(GPIO_4) U10.1(CS#)
GPIO_8: D1.2(CATHODE) R382.1 R383.1 U9.12(PME)  [also labelled PME / LED_2 / USB3.0_LED]
LED_0: LED34.2(CATHODE) R380.1 U9.19(LED_0)
LED_1: LED35.2(CATHODE) R379.1 U9.20(LED_1)
RESET_N: C187.1 R376.2 U9.25(RST_N)
SSRX_N: C184.2 U9.8(SSUSB_RXA)
SSRX_P: C186.2 U9.9(SSUSB_RXB)
SSTX_N: C183.1 U9.5(SSUSB_TXA)
SSTX_P: C185.1 U9.6(SSUSB_TXB)
TYPE_C_CC1: J5.A5(CC1) R620.1
TYPE_C_CC2: J5.B5(CC2) R623.2
TYPE_C_SSRX1_N: C469.2 J5.B10(SSRXN1)
TYPE_C_SSRX1_P: C468.2 J5.B11(SSRXP1)
TYPE_C_SSRX2_N: C470.2 J5.B3(SSTXN2)
TYPE_C_SSRX2_P: C471.2 J5.B2(SSTXP2)
TYPE_C_SSTX1_N: C465.2 J5.A3(SSTXN1)
TYPE_C_SSTX1_P: C464.2 J5.A2(SSTXP1)
TYPE_C_SSTX2_N: C466.2 J5.A10(SSRXN2)
TYPE_C_SSTX2_P: C467.2 J5.A11(SSRXP2)
TYPE_C_SSUSBRX1_N: C469.1 U22.7(RX1_N)
TYPE_C_SSUSBRX1_P: C468.1 U22.6(RX1_P)
TYPE_C_SSUSBRX2_N: C470.1 U22.8(RX2_N)
TYPE_C_SSUSBRX2_P: C471.1 U22.9(RX2_P)
TYPE_C_SSUSBTX1_N: C465.1 U22.3(TX1_N)
TYPE_C_SSUSBTX1_P: C464.1 U22.2(TX1_P)
TYPE_C_SSUSBTX2_N: C466.1 U22.4(TX2_N)
TYPE_C_SSUSBTX2_P: C467.1 U22.5(TX2_P)
XTL20N: R389.2 U9.28(XTAL_OUT)
XTL20P: C208.1 U9.27(XTAL_IN) Y1.1
NetC209_1: C209.1 R389.1 Y1.3
NetD1_1: D1.1(ANODE) R381.2
NetL9_1: L9.1 U9.16(LX)
NetLED34_1: LED34.1(ANODE) R360.1
NetLED35_1: LED35.1(ANODE) R361.1
NetR366_2: R366.2 U9.11(VBUS)
NetR375_1: R375.1 U9.29(RSET)
NetR384_2: R384.2 U10.2(SO/SIO1)
NetR385_1: R385.1 U10.7(NC/SIO3)
NetR386_2: R386.2 U10.3(WP#/SIO2)
NetR619_2: R619.2 U22.10(REXT)
NetR620_2: R620.2 R621.2 U22.1(CC1)
NetR622_2: R622.2 R623.1 U22.28(CC2)
NetR624_2: R624.2 U22.13(HIGH_Z_CC)
NetR625_1: R625.1 U22.25(CE)
NetR626_1: R626.1 U22.24(CURRENT_SETTING_IN_0)
NetR627_1: R627.1 U22.23(CURRENT_SETTING_IN_1)

Not connected (* = marked no-connect by the designer): J5 A4(VBUS) A8(SBU1) A9(VBUS) B4(VBUS) B8(SBU2) B9(VBUS); U22 11(VCONN_OC) 12(VCONN_UVLO) 14(CURRENT_SETTING_OUT_0) 15(CURRENT_SETTING_OUT_1) 16(ATTACHED_STATUS) 22(ORI_STATUS)

### Layout directives
differential pair: AX88179_D_N, AX88179_D_P, AX88179_MDI0_N, AX88179_MDI0_P, AX88179_MDI1_N, AX88179_MDI1_P, AX88179_MDI2_N, AX88179_MDI2_P, AX88179_MDI3_N, AX88179_MDI3_P, AX88179_SSRX_N, AX88179_SSRX_P, AX88179_SSTX_N, AX88179_SSTX_P, AX88179A_MDI0_N, AX88179A_MDI0_P, AX88179A_MDI1_N, AX88179A_MDI1_P, AX88179A_MDI2_N, AX88179A_MDI2_P, AX88179A_MDI3_N, AX88179A_MDI3_P, D_N, D_P, SSRX_N, SSRX_P, SSTX_N, SSTX_P, TYPE_C_SSRX1_N, TYPE_C_SSRX1_P, TYPE_C_SSRX2_N, TYPE_C_SSRX2_P, TYPE_C_SSTX1_N, TYPE_C_SSTX1_P, TYPE_C_SSTX2_N, TYPE_C_SSTX2_P, TYPE_C_SSUSBRX1_N, TYPE_C_SSUSBRX1_P, TYPE_C_SSUSBRX2_N, TYPE_C_SSUSBRX2_P, TYPE_C_SSUSBTX1_N, TYPE_C_SSUSBTX1_P, TYPE_C_SSUSBTX2_N, TYPE_C_SSUSBTX2_P

### Notes on the sheet
- (near LED35) GREEN
- (near LED34) GREEN
- For EMI / ESD
  (Optional)
- *Note2-3
- Reset
  circuit
- (near R376) (Optional)
- (near U9) AX88179B
  AX88179A
- (near R378) *Note2-6
- PME/LED_2/USB3.0_LED
- (Optional)
- (near R378) For EMI
  (Reserve)
  R24 = 22R
  C34 = 10pF
- (near U9) *Note2-7
- *Note2-15
- (near R383) External Wake up pin for USB_IF
- SPI Flash
- *Note2-10
- *Note2-14
- (near Y1) 20MHz +/- 30ppm Crystal
- *Note2-1
- For EMI
- (Reserve)
- (in symbol LED_P2_Dup1) A; C
- (in symbol TitleBlock0) Title; Size; Document Number; Rev; Date:; Sheet; of

### Library data of the parts
*#9 = TitleBlock0: Page Create Date: March  8, 1995; Page Size: =PageSize; Page Modify Date: =ModifiedDate
C183-C186 C464-C473 = CAP_NP: as C164 on sheet 12-RTL8111H-3; HEIGHT: 0.635MM; ROHS: Yes; TOL: 10%; PCB Footprint: C0402
C187 = CAP NP_Dup2: Part Reference: C10; PCB Footprint: C0402
C192 = CAP NP_0: Part Reference: C15; Value: 0.1uF; PCB Footprint: C0402
C193 = CAP NP_Dup2: Part Reference: C16; PCB Footprint: C0402
C194 = CAP NP_Dup2: Part Reference: C17; PCB Footprint: C0402
C195 = CAP NP_Dup2: Part Reference: C18; PCB Footprint: C0402
C196 = CAP NP_Dup2: Part Reference: C19; PCB Footprint: C0402
C197 = C_Dup1: Part Reference: C20; PCB Footprint: C0603
C198 = CAP NP_Dup2: Part Reference: C21; PCB Footprint: C0402
C199 = C_Dup1: Part Reference: C22; PCB Footprint: C0603
C200 = CAP NP_Dup2: Part Reference: C23; PCB Footprint: C0402
C201 = C_Dup1: Part Reference: C24; PCB Footprint: C0603
C202 = CAP NP_Dup2: Part Reference: C25; PCB Footprint: C0402
C203 = C_Dup1: Part Reference: C26; PCB Footprint: C0603
C204 = CAP NP_Dup2: Part Reference: C27; PCB Footprint: C0402
C205 = CAP NP_Dup2: Part Reference: C28; PCB Footprint: C0402
C206 = CAP NP_Dup2: Part Reference: C29; PCB Footprint: C0402
C208 = CAP NP_Dup1: Part Reference: C30; PCB Footprint: C0402
C209 = CAP NP_Dup1: Part Reference: C31; PCB Footprint: C0402
C210 = CAP NP_Dup2: Part Reference: C33; PCB Footprint: C0402
C211 = CAP NP_Dup2: Part Reference: C34; PCB Footprint: C0402
C212 = CAP NP_Dup2: Part Reference: C35; PCB Footprint: C0402
C213 = CAP NP_Dup2: Part Reference: C36; PCB Footprint: C0402
C214 = CAP NP_Dup2: Part Reference: C37; PCB Footprint: C0402
C215 = CAP NP_Dup2: Part Reference: C38; PCB Footprint: C0402
D1 = LED: Part Reference: D1; PCB Footprint: LED0603
FB38 = Inductor: as FB14 on sheet 12-RTL8111H-3; Published: 8-Jun-2000; LatestRevisionDate: 29-May-2009; LatestRevisionNote: IPC-7351 Footprint Added.; PackageReference: 0402-A; Publisher: Altium Limited; PackageDescription: Chip Inductor; Code_JEITA: 0402
J5 = GT-USB-7092C: Manufacturer: G-Switch(品赞); Add into BOM: yes; Connector Type: Type-C; Gender: 母; Number of Contacts: 24P; Number of Ports: 1; Current Rating - Power (Max): 5A; Rated Voltage (Max): 24V; Connect-Disconnect Life: 1万次; Center Height: 7.2mm; Core Colour: 黑色; Symbol: GT-USB-7092C; Device: GT-USB-7092C; LCSC Part Name: Type-C 母 侧贴; Supplier Part: C22471968; Manufacturer Part: GT-USB-7092C; Supplier Footprint: SMD; JLCPCB Part Class: Extended Part; Datasheet: https://atta.szlcsc.com/upload/public/pdf/source/20240624/0752ADA6134B10077FCDD9A2DA872EFC.pdf; Supplier: LCSC; Convert to PCB: yes; Standard: USB 3.1; Mounting Style: 侧贴; Length: 13.9mm; Operating Temperature Range: -40℃~+85℃; Comment_1: GT-USB-7092C
L7 = BEAD_FERRITE: BLM18EG121SH1D/MURATA; Part Reference: L1; PART_TYPE: FERRITE\BEAD; CLASS: DISCRETE; AGILE_PN: 180-78025; MFG_NAME01: MURATA; MFG_PN01: BLM18KG121TN1; CAD_APPROVED: Yes; FPLIST: IND_0603A,0603_CC; ROHS: Yes; HEIGHT: 0.75MM; PCB Footprint: L0603
L8 = BEAD_FERRITE: BLM18EG121SH1D/MURATA; Part Reference: L2; PART_TYPE: FERRITE\BEAD; CLASS: DISCRETE; AGILE_PN: 180-78025; MFG_NAME01: MURATA; MFG_PN01: BLM18KG121TN1; CAD_APPROVED: Yes; FPLIST: IND_0603A,0603_CC; ROHS: Yes; HEIGHT: 0.75MM; PCB Footprint: L0603
L9 = INDUCTOR: Part Reference: L3; PCB Footprint: L0805
L10 = BEAD_FERRITE: BLM18EG121SH1D/MURATA; Part Reference: L4; PART_TYPE: FERRITE\BEAD; CLASS: DISCRETE; FPLIST: IND_0603A,0603_CC; CAD_APPROVED: Yes; MFG_PN01: BLM18KG121TN1; MFG_NAME01: MURATA; AGILE_PN: 180-78025; HEIGHT: 0.75MM; ROHS: Yes; PCB Footprint: L0603
LED34 = LED_P2_Dup1: NCD0603G1/NATIONSTAR; Part Reference: LED1; PCB Footprint: LED0603
LED35 = LED_P2_Dup1: NCD0603B1/NATIONSTAR; Part Reference: LED2; PCB Footprint: LED0603
R360 = RES_Dup2: AC0402FR-071KL/YAGEO; Part Reference: R1; CLASS: DISCRETE; PCB Footprint: R0402
R361 = RES_Dup2: AC0402FR-071KL/YAGEO; Part Reference: R2; CLASS: DISCRETE; PCB Footprint: R0402
R363 R365 = RES_Dup2: as R340 on sheet 12-RTL8111H-3; ROHS: Yes; HEIGHT: 0.4MM; PCB Footprint: R0402
R366 = R_Dup1: Part Reference: R15; Value: 4.7K; PCB Footprint: R0402
R367 = RES_Dup2: AC0402FR-070RL/YAGEO; Part Reference: R7; CLASS: DISCRETE; TOL: 5%; AGILE_PN: 470-75790; Tolerance: 1%; MFG_NAME01: YAGEO; MFG_PN01: CR-02FL6---33R; CAD_APPROVED: Yes; FPLIST: RC0603_OV; SIGNAL_MODEL: DEFAULT_RESISTOR_33.000000OHM_2_1; HEIGHT: 0.4MM; ROHS: Yes; PCB Footprint: R0402
R368 = RES_Dup2: AC0402FR-070RL/YAGEO; Part Reference: R8; CLASS: DISCRETE; SIGNAL_MODEL: DEFAULT_RESISTOR_33.000000OHM_2_1; FPLIST: RC0603_OV; CAD_APPROVED: Yes; MFG_PN01: CR-02FL6---33R; MFG_NAME01: YAGEO; Tolerance: 1%; AGILE_PN: 470-75790; TOL: 5%; ROHS: Yes; HEIGHT: 0.4MM; PCB Footprint: R0402
R369 = RES_Dup2: AC0402FR-070RL/YAGEO; Part Reference: R9; CLASS: DISCRETE; SIGNAL_MODEL: DEFAULT_RESISTOR_33.000000OHM_2_1; FPLIST: RC0603_OV; CAD_APPROVED: Yes; MFG_PN01: CR-02FL6---33R; MFG_NAME01: YAGEO; Tolerance: 1%; AGILE_PN: 470-75790; TOL: 5%; ROHS: Yes; HEIGHT: 0.4MM; PCB Footprint: R0402
R370 = RES_Dup2: AC0402FR-070RL/YAGEO; Part Reference: R14; CLASS: DISCRETE; SIGNAL_MODEL: DEFAULT_RESISTOR_33.000000OHM_2_1; FPLIST: RC0603_OV; CAD_APPROVED: Yes; MFG_PN01: CR-02FL6---33R; MFG_NAME01: YAGEO; Tolerance: 1%; AGILE_PN: 470-75790; TOL: 5%; ROHS: Yes; HEIGHT: 0.4MM; PCB Footprint: R0402
R371 = RES_Dup2: AC0402FR-070RL/YAGEO; Part Reference: R10; CLASS: DISCRETE; SIGNAL_MODEL: DEFAULT_RESISTOR_33.000000OHM_2_1; FPLIST: RC0603_OV; CAD_APPROVED: Yes; MFG_PN01: CR-02FL6---33R; MFG_NAME01: YAGEO; Tolerance: 1%; AGILE_PN: 470-75790; TOL: 5%; ROHS: Yes; HEIGHT: 0.4MM; PCB Footprint: R0402
R372 = RES_Dup2: AC0402FR-070RL/YAGEO; Part Reference: R11; CLASS: DISCRETE; SIGNAL_MODEL: DEFAULT_RESISTOR_33.000000OHM_2_1; FPLIST: RC0603_OV; CAD_APPROVED: Yes; MFG_PN01: CR-02FL6---33R; MFG_NAME01: YAGEO; Tolerance: 1%; AGILE_PN: 470-75790; TOL: 5%; ROHS: Yes; HEIGHT: 0.4MM; PCB Footprint: R0402
R373 = RES_Dup2: AC0402FR-070RL/YAGEO; Part Reference: R12; CLASS: DISCRETE; SIGNAL_MODEL: DEFAULT_RESISTOR_33.000000OHM_2_1; FPLIST: RC0603_OV; CAD_APPROVED: Yes; MFG_PN01: CR-02FL6---33R; MFG_NAME01: YAGEO; Tolerance: 1%; AGILE_PN: 470-75790; TOL: 5%; ROHS: Yes; HEIGHT: 0.4MM; PCB Footprint: R0402
R374 = RES_Dup2: AC0402FR-070RL/YAGEO; Part Reference: R13; CLASS: DISCRETE; SIGNAL_MODEL: DEFAULT_RESISTOR_33.000000OHM_2_1; FPLIST: RC0603_OV; CAD_APPROVED: Yes; MFG_PN01: CR-02FL6---33R; MFG_NAME01: YAGEO; Tolerance: 1%; AGILE_PN: 470-75790; TOL: 5%; ROHS: Yes; HEIGHT: 0.4MM; PCB Footprint: R0402
R375 = R: Part Reference: R16; PCB Footprint: R0402
R376 = R: Part Reference: R17; PCB Footprint: R0402
R377 = R_Dup1: Part Reference: R18; PCB Footprint: R0402
R378 = R_Dup2: Part Reference: R19; PCB Footprint: R0402
R379 = R_Dup4: Part Reference: R20; PCB Footprint: R0402
R380 = R_Dup1: Part Reference: R21; PCB Footprint: R0402
R381 = R_Dup2: Part Reference: R22; PCB Footprint: R0402
R382 = R_Dup2: Part Reference: R23; PCB Footprint: R0402
R383 = R_Dup2: Part Reference: R24; PCB Footprint: R0402
R384 = R_2: Part Reference: R25; Value: 0R/1%/0402; PCB Footprint: R0402
R385 = R_1: Part Reference: R26; Value: 4.7K/1%/0402; PCB Footprint: R0402
R386 = R_0: Part Reference: R27; Value: 4.7K/1%/0402; PCB Footprint: R0402
R387 = R_3: Part Reference: R28; Value: 4.7K/1%/0402; PCB Footprint: R0402
R388 = R_Dup2: Part Reference: R29; Value: 4.7K/1%/0402; PCB Footprint: R0402
R389 = R_Dup4: Part Reference: R30; Value: 200; PCB Footprint: R0402
R619-R627 = Res Semi: Semiconductor Resistor; Value: 240R; Published: 8-Jun-2000; LatestRevisionDate: 17-Jul-2002; LatestRevisionNote: Re-released for DXP Platform.; PackageReference: AXIAL-0.5; Publisher: Altium Limited; PackageDescription: Axial Device, Thru-Hole; 2 Leads; 0.5 in Pin Spacing
U9 = USB3 TO Gbe_1: Part Reference: U3; PCB Footprint: QFN40-AX88179A; Value: AX88179B/AX88179A
U10 = MX25L1606E_2: Part Reference: U6; Value: MX25L1636E/NC; PCB Footprint: sop8-MX25L1636EM2I-08G
U22 = vl60
Y1 = CRYSTAL4/SM_0: Part Reference: Y1; Value: 20M CRYSTAL; PCB Footprint: CRY3225